# EAGLE schematic ManualBot (EAGLE 8.0.1)
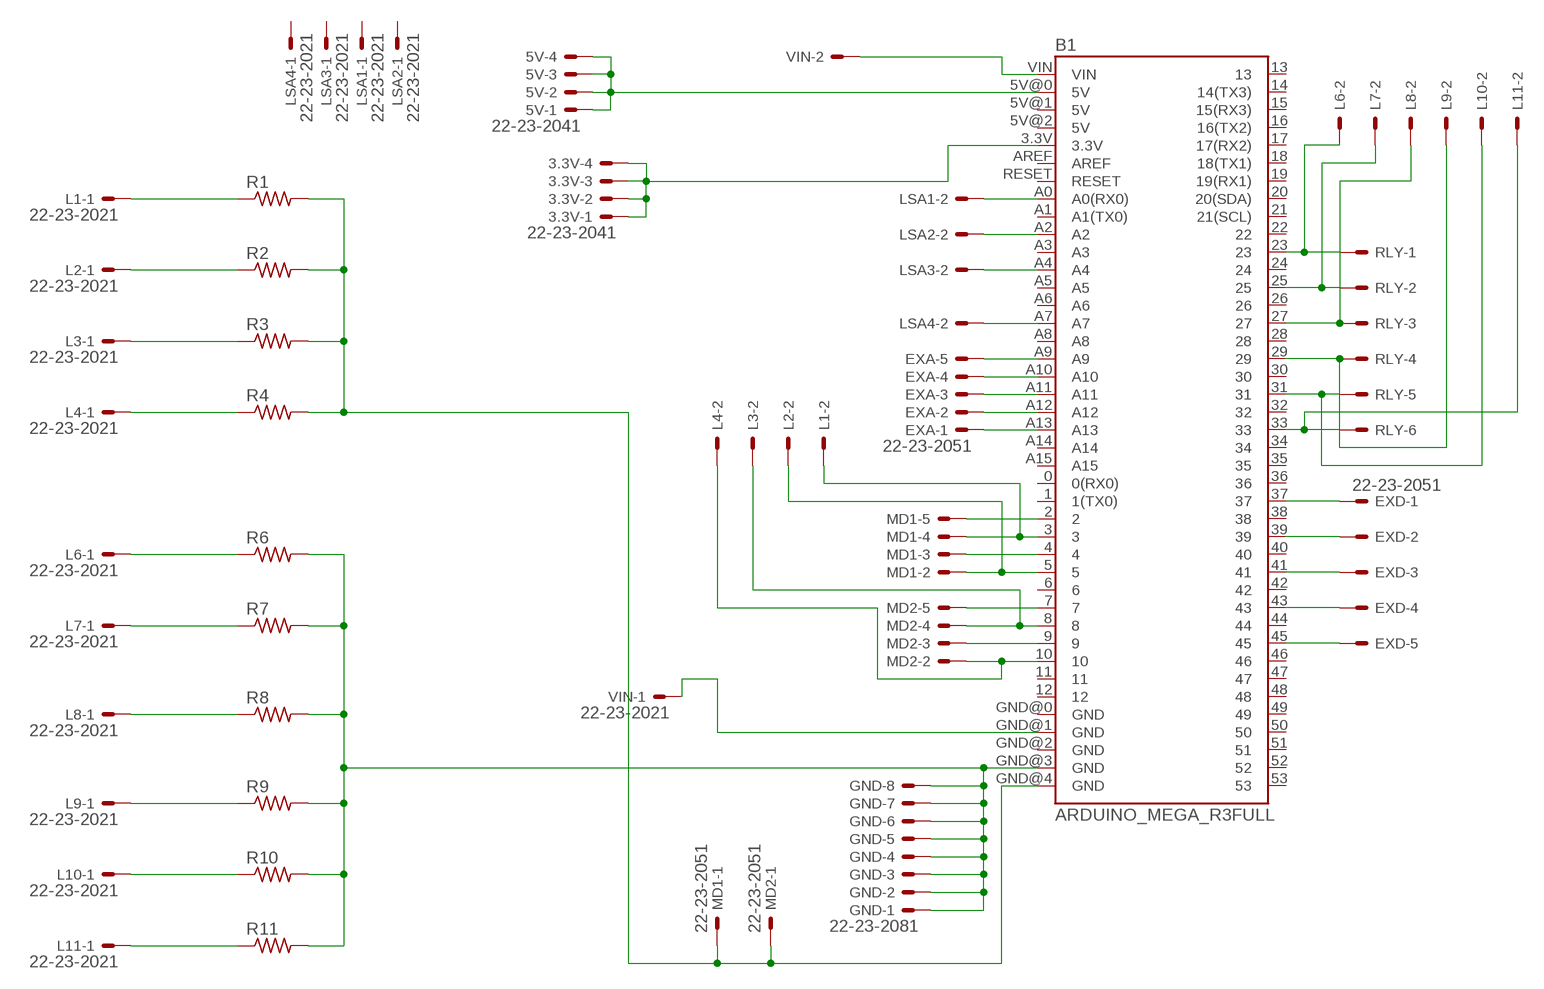
[diagram p0: schematic, sheet 1]

## Parts
3.3V  22-23-2041  [22-23-2041]
5V  22-23-2041  [22-23-2041]
B1  ARDUINO_MEGA_R3FULL  [ARDUINO_MEGA]
EXA  22-23-2051  [22-23-2051]
EXD  22-23-2051  [22-23-2051]
GND  22-23-2081  [22-23-2081]
L1  22-23-2021  [22-23-2021]
L2  22-23-2021  [22-23-2021]
L3  22-23-2021  [22-23-2021]
L4  22-23-2021  [22-23-2021]
L6  22-23-2021  [22-23-2021]
L7  22-23-2021  [22-23-2021]
L8  22-23-2021  [22-23-2021]
L9  22-23-2021  [22-23-2021]
L10  22-23-2021  [22-23-2021]
L11  22-23-2021  [22-23-2021]
LSA1  22-23-2021  [22-23-2021]
LSA2  22-23-2021  [22-23-2021]
LSA3  22-23-2021  [22-23-2021]
LSA4  22-23-2021  [22-23-2021]
MD1  22-23-2051  [22-23-2051]
MD2  22-23-2051  [22-23-2051]
R1  FLIPFLOP-RES  [0805-THM]
R2  FLIPFLOP-RES  [0805-THM]
R3  FLIPFLOP-RES  [0805-THM]
R4  FLIPFLOP-RES  [0805-THM]
R6  FLIPFLOP-RES  [0805-THM]
R7  FLIPFLOP-RES  [0805-THM]
R8  FLIPFLOP-RES  [0805-THM]
R9  FLIPFLOP-RES  [0805-THM]
R10  FLIPFLOP-RES  [0805-THM]
R11  FLIPFLOP-RES  [0805-THM]
RLY  22-23-2061  [22-23-2061]
VIN  22-23-2021  [22-23-2021]

## Nets
B$1: B1.GND@3(GND) GND.1 GND.2 GND.3 GND.4 GND.5 GND.6 GND.7 GND.8 R6.2 R7.2 R8.2 R9.2 R10.2 R11.2
N$1: B1.2 MD1.5
N$2: B1.3 L1.2 MD1.4
N$3: B1.4 MD1.3
N$4: B1.A9 EXA.5
N$5: 5V.1 5V.2 5V.3 5V.4 B1.5V@0(5V)
N$6: B1.7 MD2.5
N$7: B1.8 L3.2 MD2.4
N$8: B1.9 MD2.3
N$9: B1.10 L4.2 MD2.2
N$10: B1.A0(A0(RX0)) LSA1.2
N$12: 3.3V.1 3.3V.2 3.3V.3 3.3V.4 B1.3.3V
N$13: B1.A4 LSA3.2
N$14: B1.A2 LSA2.2
N$15: B1.A7 LSA4.2
N$16: B1.GND@1(GND) VIN.1
N$18: B1.27 L8.2 RLY.3
N$20: B1.A10 EXA.4
N$23: L1.1 R1.1
N$24: L2.1 R2.1
N$25: B1.VIN VIN.2
N$26: L3.1 R3.1
N$27: L4.1 R4.1
N$29: L6.1 R6.1
N$30: L7.1 R7.1
N$31: L8.1 R8.1
N$32: B1.5 L2.2 MD1.2
N$33: L9.1 R9.1
N$34: L10.1 R10.1
N$35: L11.1 R11.1
N$36: B1.A11 EXA.3
N$37: B1.A12 EXA.2
N$38: B1.23 L6.2 RLY.1
N$39: B1.A13 EXA.1
N$40: B1.25 L7.2 RLY.2
N$41: B1.29 L9.2 RLY.4
N$42: B1.31 L10.2 RLY.5
N$43: B1.33 L11.2 RLY.6
N$46: B1.GND@4(GND) MD1.1 MD2.1 R1.2 R2.2 R3.2 R4.2
N$49: B1.37 EXD.1
N$50: B1.39 EXD.2
N$51: B1.41 EXD.3
N$52: B1.43 EXD.4
N$53: B1.45 EXD.5
Unconnected: B1.0(0(RX0)) B1.1(1(TX0)) B1.5V@1(5V) B1.5V@2(5V) B1.6 B1.11 B1.12 B1.13 B1.14(14(TX3)) B1.15(15(RX3)) B1.16(16(TX2)) B1.17(17(RX2)) B1.18(18(TX1)) B1.19(19(RX1)) B1.20(20(SDA)) B1.21(21(SCL)) B1.22 B1.24 B1.26 B1.28 B1.30 B1.32 B1.34 B1.35 B1.36 B1.38 B1.40 B1.42 B1.44 B1.46 B1.47 B1.48 B1.49 B1.50 B1.51 B1.52 B1.53 B1.A1(A1(TX0)) B1.A3 B1.A5 B1.A6 B1.A8 B1.A14 B1.A15 B1.AREF B1.GND@0(GND) B1.GND@2(GND) B1.RESET LSA1.1 LSA2.1 LSA3.1 LSA4.1

## Library data of the parts
3.3V 5V = con-molex:22-23-2041: .100" (2.54mm) Center Header - 4 Pin; MF: MOLEX; MPN: 22-23-2041; OC_FARNELL: 1462920; OC_NEWARK: 38C0355
B1 = SparkFun-Boards:ARDUINO_MEGA_R3: Arduino Mega R3 ATmega2560 R3 compatible footprint. SparkFun Products: Arduino Mega 2560 R3 <https://www.sparkfun.com/products/11061>
EXA EXD MD1 MD2 = con-molex:22-23-2051: .100" (2.54mm) Center Header - 5 Pin; MF: MOLEX; MPN: 22-23-2051; OC_FARNELL: 1462952; OC_NEWARK: 38C9178
GND = con-molex:22-23-2081: .100" (2.54mm) Center Header - 8 Pin; MF: MOLEX; MPN: 22-23-2081; OC_FARNELL: 1756826; OC_NEWARK: 01C7592
L1-L4 L6-L11 LSA1-LSA4 VIN = con-molex:22-23-2021: .100" (2.54mm) Center Header - 2 Pin; MF: MOLEX; MPN: 22-23-2021; OC_FARNELL: 1462926; OC_NEWARK: 25C3832
R1-R4 R6-R11 = adafruit:FLIPFLOP-RES: Flip Flop resistor An 0805 resistor inside a standard 1/4W 5% resistor. Makes for easy mods
RLY = con-molex:22-23-2061: .100" (2.54mm) Center Header - 6 Pin; MF: MOLEX; MPN: 22-23-2061; OC_FARNELL: 1462922; OC_NEWARK: 27C1933